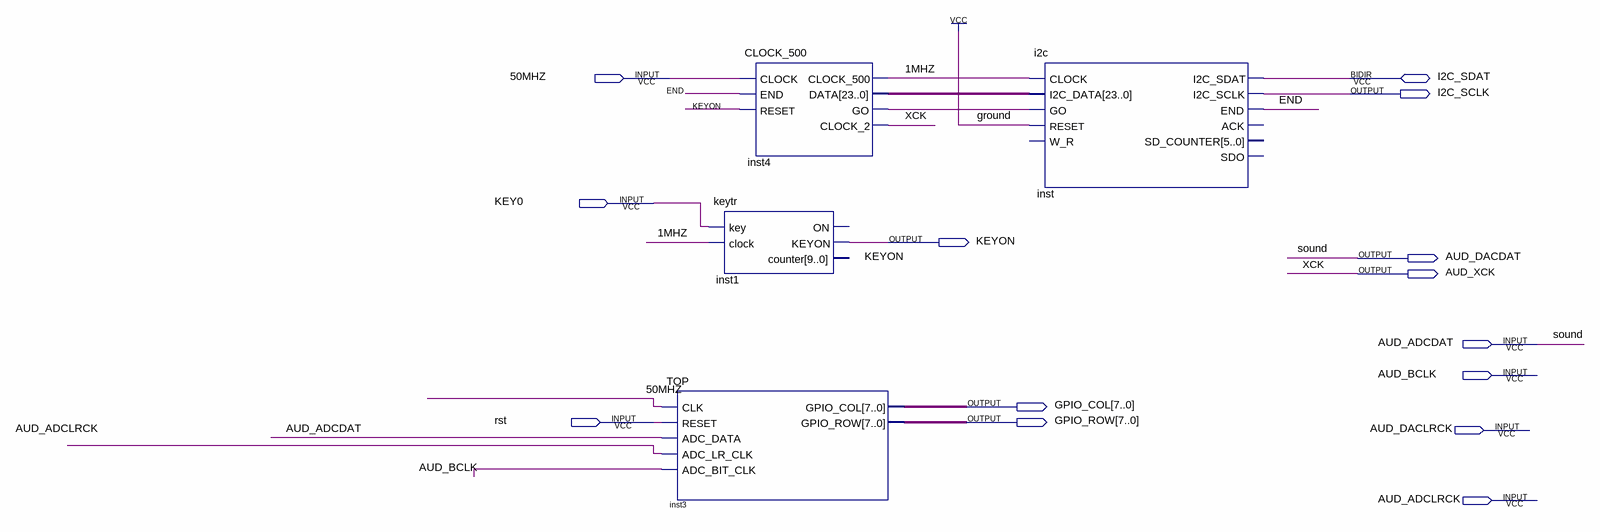
[diagram p0: schematic sheet]
// Quartus schematic DE2_i2sound.bdf as structural Verilog: 4 symbols, 14 pins
module DE2_i2sound (
  input  \50MHZ ,
  input  KEY0,
  input  AUD_ADCDAT,
  input  AUD_BCLK,
  input  rst,
  input  AUD_DACLRCK,
  input  AUD_ADCLRCK,
  inout  I2C_SDAT,
  output I2C_SCLK,
  output KEYON,
  output AUD_DACDAT,
  output AUD_XCK,
  output [7:0] GPIO_COL,
  output [7:0] GPIO_ROW
);

  wire \1MHZ , END, inst4_go;
  wire [23:0] inst4_data;

  keytr inst1 (.key(KEY0), .clock(\1MHZ ), .KEYON(KEYON));  // open: ON, counter
  TOP inst3 (
    .CLK(\50MHZ ), .RESET(rst), .ADC_DATA(AUD_ADCDAT), .ADC_LR_CLK(AUD_ADCLRCK), .ADC_BIT_CLK(AUD_BCLK),
    .GPIO_COL(GPIO_COL), .GPIO_ROW(GPIO_ROW));
  CLOCK_500 inst4 (
    .CLOCK(\50MHZ ), .END(END), .RESET(KEYON), .CLOCK_500(\1MHZ ), .DATA(inst4_data), .GO(inst4_go),
    .CLOCK_2(AUD_XCK));
  i2c inst (
    .CLOCK(\1MHZ ), .I2C_DATA(inst4_data), .GO(inst4_go), .RESET(1'b1), .I2C_SCLK(I2C_SCLK), .END(END),
    .I2C_SDAT(I2C_SDAT));  // open: W_R, ACK, SD_COUNTER, SDO

  assign AUD_DACDAT = AUD_ADCDAT;

  // Other names for the same wires on the sheet: sound = AUD_ADCDAT; XCK = AUD_XCK
endmodule
